# EAGLE schematic ESPNTPServer (EAGLE 7.5.0)
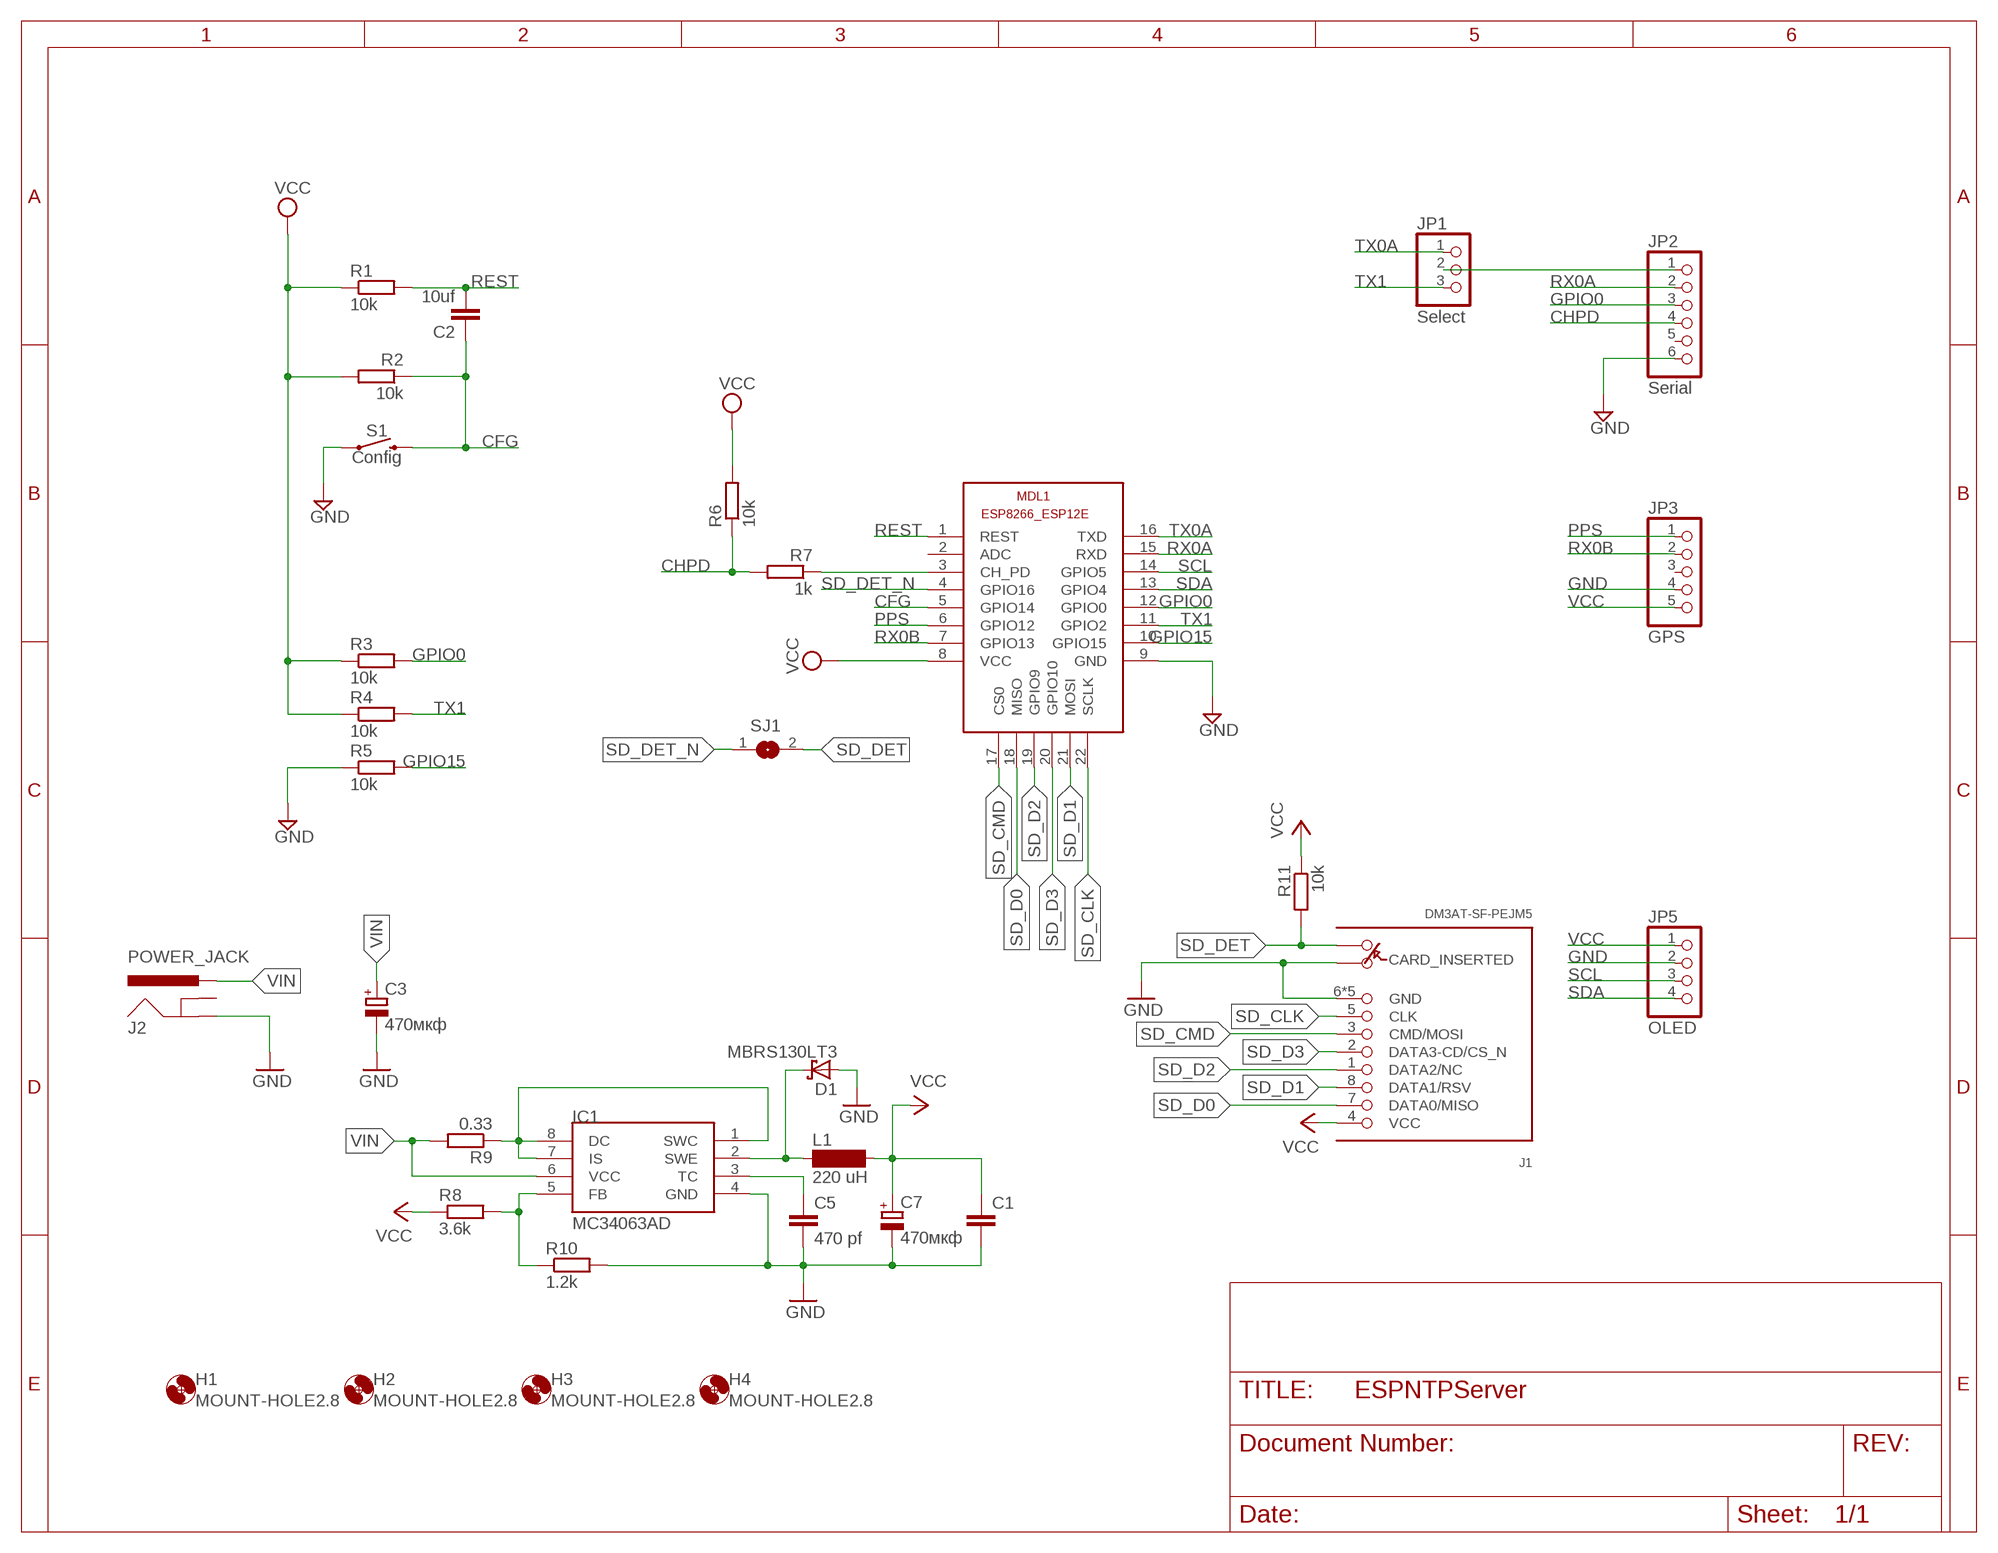
[diagram p0: schematic, sheet 1]

## Parts
C1  C-EUC1206  [C1206]
C2  10uf  C-EU050-025X075  [C050-025X075]
C3  470мкф  CPOL-EUE3.5-8  [E3,5-8]
C5  470 pf  C-EUC1206  [C1206]
C7  470мкф  CPOL-EUE3.5-8  [E3,5-8]
D1  MBRS130LT3  [SMB]
H1  MOUNT-HOLE2.8  [2,8]
H2  MOUNT-HOLE2.8  [2,8]
H3  MOUNT-HOLE2.8  [2,8]
H4  MOUNT-HOLE2.8  [2,8]
IC1  MC34063AD  [SOIC8]
J1  DM3AT-SF-PEJM5  [DM3AT-SF-PEJM5]
J2  POWER_JACK  [POWER_JACK_PTH]
JP1  Select  PINHD-1X3  [1X03]
JP2  Serial  PINHD-1X6  [1X06]
JP3  GPS  PINHD-1X5  [1X05]
JP5  OLED  PINHD-1X4  [1X04]
L1  220 uH  SD12K-82  [SD12K-82]
MDL1  ESP8266-12F  ESP8266-12EESP8266-ESP12E  [ESP8266-ESP12E]
R1  10k  R-EU_M1206  [M1206]
R2  10k  R-EU_M1206  [M1206]
R3  10k  R-EU_M1206  [M1206]
R4  10k  R-EU_M1206  [M1206]
R5  10k  R-EU_M1206  [M1206]
R6  10k  R-EU_M1206  [M1206]
R7  1k  R-EU_M1206  [M1206]
R8  3.6k  R-EU_M1206  [M1206]
R9  0.33  R-EU_0411/3V  [0411V]
R10  1.2k  R-EU_M1206  [M1206]
R11  10k  R-EU_M1206  [M1206]
S1  Config  MOMENTARY-SWITCH-SPST-PTH-6.0MM  [TACTILE_SWITCH_PTH_6.0MM]
SJ1  SJ  [SJ]

## Nets
CFG: C2.1 MDL1.5(GPIO14) R2.1 S1.3
CHPD: JP2.4 R6.1 R7.2
GND [power]: C1.2 C3.- C5.2 C7.- D1.A IC1.4(GND) J1.6(GND) J1.A J1.MOUNT0(GND) J1.MOUNT1(GND) J1.MOUNT2(GND) J1.MOUNT3(GND) J2.GND JP2.6 JP3.4 JP5.2 MDL1.9(GND) R5.1 R10.2 S1.1
GPIO0: JP2.3 MDL1.12(GPIO0) R3.2
GPIO15: MDL1.10(GPIO15) R5.2
N$1: JP1.2 JP2.1
N$2: IC1.1(SWC) IC1.7(IS) IC1.8(DC) R9.1
N$3: C5.1 IC1.3(TC)
N$4: MDL1.3(CH_PD) R7.1
N$5: D1.C IC1.2(SWE) L1.1
N$6: IC1.5(FB) R8.2 R10.1
PPS: JP3.1 MDL1.6(GPIO12)
REST: C2.2 MDL1.1(REST) R1.2
RX0A: JP2.2 MDL1.15(RXD)
RX0B: JP3.2 MDL1.7(GPIO13)
SCL: JP5.3 MDL1.14(GPIO5)
SD_CLK: J1.5(CLK) MDL1.22(SCLK)
SD_CMD: J1.3(CMD/MOSI) MDL1.17(CS0)
SD_D0: J1.7(DATA0/MISO) MDL1.18(MISO)
SD_D1: J1.8(DATA1/RSV) MDL1.21(MOSI)
SD_D2: J1.1(DATA2/NC) MDL1.19(GPIO9)
SD_D3: J1.2(DATA3-CD/CS_N) MDL1.20(GPIO10)
SD_DET: J1.B R11.2 SJ1.2
SD_DET_N: MDL1.4(GPIO16) SJ1.1
SDA: JP5.4 MDL1.13(GPIO4)
TX0A: JP1.1 MDL1.16(TXD)
TX1: JP1.3 MDL1.11(GPIO2) R4.2
VCC [power]: C1.1 C7.+ J1.4(VCC) JP3.5 JP5.1 L1.2 MDL1.8(VCC) R1.1 R2.2 R3.1 R4.1 R6.2 R8.1 R11.1
VIN [power]: C3.+ IC1.6(VCC) J2.PWR R9.2
Unconnected: J2.GNDBREAK JP2.5 JP3.3 MDL1.2(ADC)

## Library data of the parts
C1 C5 = resistor:C-EU: CAPACITOR, European symbol
C2 = rcl:C-EU: CAPACITOR, European symbol; SPICEPREFIX: C
C3 C7 = resistor:CPOL-EU: POLARIZED CAPACITOR, European symbol
D1 = diode:MBRS130LT3: Schottky Power Rectifier Source: http://www.onsemi.com/pub/Collateral/MBRS130LT3-D.PDF
H1-H4 = holes:MOUNT-HOLE: MOUNTING HOLE with drill center marker
IC1 = mc34063:MC34063
J1 = connector:DM3AT-SF-PEJM5: CONN MICRO SD R/A PUSH-PUSH SMD; DESCRIPTION: CONN MICRO SD CARD PUSH-PUSH R/A; DIGIKEY: HR1964CT-ND; MANUFACTURER: Hirose Electric Co Ltd; MPN: DM3AT-SF-PEJM5
J2 = ESPNTPServer:POWER_JACK: Power Jack Connector This is the standard 5.5mm barrel jack for power. The PTH is the most common, proven, reliable, footprint. The Slot footprint only works if the mill layer is transmitted to the PCB fab house so be warned. Here are the connectors we sell at SparkFun: DC Barrel Power Jack/Connector <https://www.sparkfun.com/products/119> (PRT-00119) DC Barrel Power Jack/Connector (SMD) <https://www.sparkfun.com/products/12748> (PRT-12748) DC Barrel Jack Adapter - Breadboard Compatible <https://www.sparkfun.com/products/10811> (PRT-10811) It is used on this SparkFun product (and many, many others): SparkFun RedBoard - Programmed with Arduino <https://www.sparkfun.com/products/12757> (DEV-12757) Also, if you need a mating power supply or connector, please check these out: Wall Adapter Power Supply - 9VDC 650mA <https://www.sparkfun.com/products/298> (TOL-00298) DC Barrel Jack Adapter - Male <https://www.sparkfun.com/products/10287> (PRT-10287); PROD_ID: CONN-08197
JP1 = pinhead:PINHD-1X3: PIN HEADER
JP2 = pinhead:PINHD-1X6: PIN HEADER
JP3 = pinhead:PINHD-1X5: PIN HEADER
JP5 = pinhead:PINHD-1X4: PIN HEADER
L1 = inductor-neosid:SD12: INDUCTOR nominal inductance; OC_FARNELL: unknown; OC_NEWARK: unknown
MDL1 = ESPNTPServer:ESP8266-12E: ESP8266-12E with additional I/O and GPIO04/05 corrected The author cannot warrant that this library is free from error or will meet your specific requirements. Created by PuceBaboon.com. Komagane, Nagano, JAPAN
R1-R11 = resistor:R-EU_: RESISTOR, European symbol
S1 = ESPNTPServer:MOMENTARY-SWITCH-SPST: Momentary Switch (Pushbutton) - SPST Normally-open (NO) SPST momentary switches (buttons, pushbuttons). Variants PTH-12MM - 12mm square, through-hole Momentary Pushbutton Switch - 12mm Square <https://www.sparkfun.com/products/9190> (COM-09190) PTH-6.0MM, PTH-6.0MM-KIT - 6.0mm square, through-hole Mini Pushbutton Switch <https://www.sparkfun.com/products/97> (COM-00097) KIT package intended for soldering kit's - only one side of pads' copper is exposed. PTH-RIGHT-ANGLE-KIT - Right-angle, through-hole Right Angle Tactile Button <https://www.sparkfun.com/products/10791> - Used on SparkFun BigTime Watch Kit <https://www.sparkfun.com/products/11734> SMD-12MM - 12mm square, surface-mount Tactile Button - SMD (12mm) <https://www.sparkfun.com/products/12993> (COM-12993) Used on SparkFun PicoBoard <https://www.sparkfun.com/products/11888> SMD-4.5MM - 4.5mm Square Trackball Switch Used on SparkFun Blackberry Trackballer Breakout <https://www.sparkfun.com/products/13169> SMD-4.6MMX2.8MM - 4.60mm x 2.80mm, surface mount Used on SparkFun SAMD21 Mini Breakout <https://www.sparkfun.com/products/13664> SMD-5.2MM, SMD-5.2-REDUNDANT - 5.2mm square, surface-mount Mini Pushbutton Switch - SMD <https://www.sparkfun.com/products/8720> (COM-08720) Used on Arduino Pro Mini <https://www.sparkfun.com/products/11114> REDUNDANT package connects both switch circuits together SMD-6.0X3.5MM - 6.0 x 3.5mm, surface mount Momentary Reset Switch SMD <https://www.sparkfun.com/products/8229> (COM-08229) SMD-6.2MM-TALL - 6.2mm square, surface mount Tactile Button - SMD (6mm) <https://www.sparkfun.com/products/12992> Used on SparkFun Digital Sandbox <https://www.sparkfun.com/products/12651> SMD-RIGHT-ANGLE - Right-angle, surface mount Used on SparkFun Block for Intel® Edison - Arduino <https://www.sparkfun.com/products/13036>; PROD_ID: SWCH-08441; SF_SKU: COM-00097
SJ1 = jumper:SJ: SMD solder JUMPER

## Net classes
1 power: width 0.508 mm